# Altium schematic sheet Sensor_Filters.SchDoc
size B; SheetNumber: 12; SheetTotal: 12
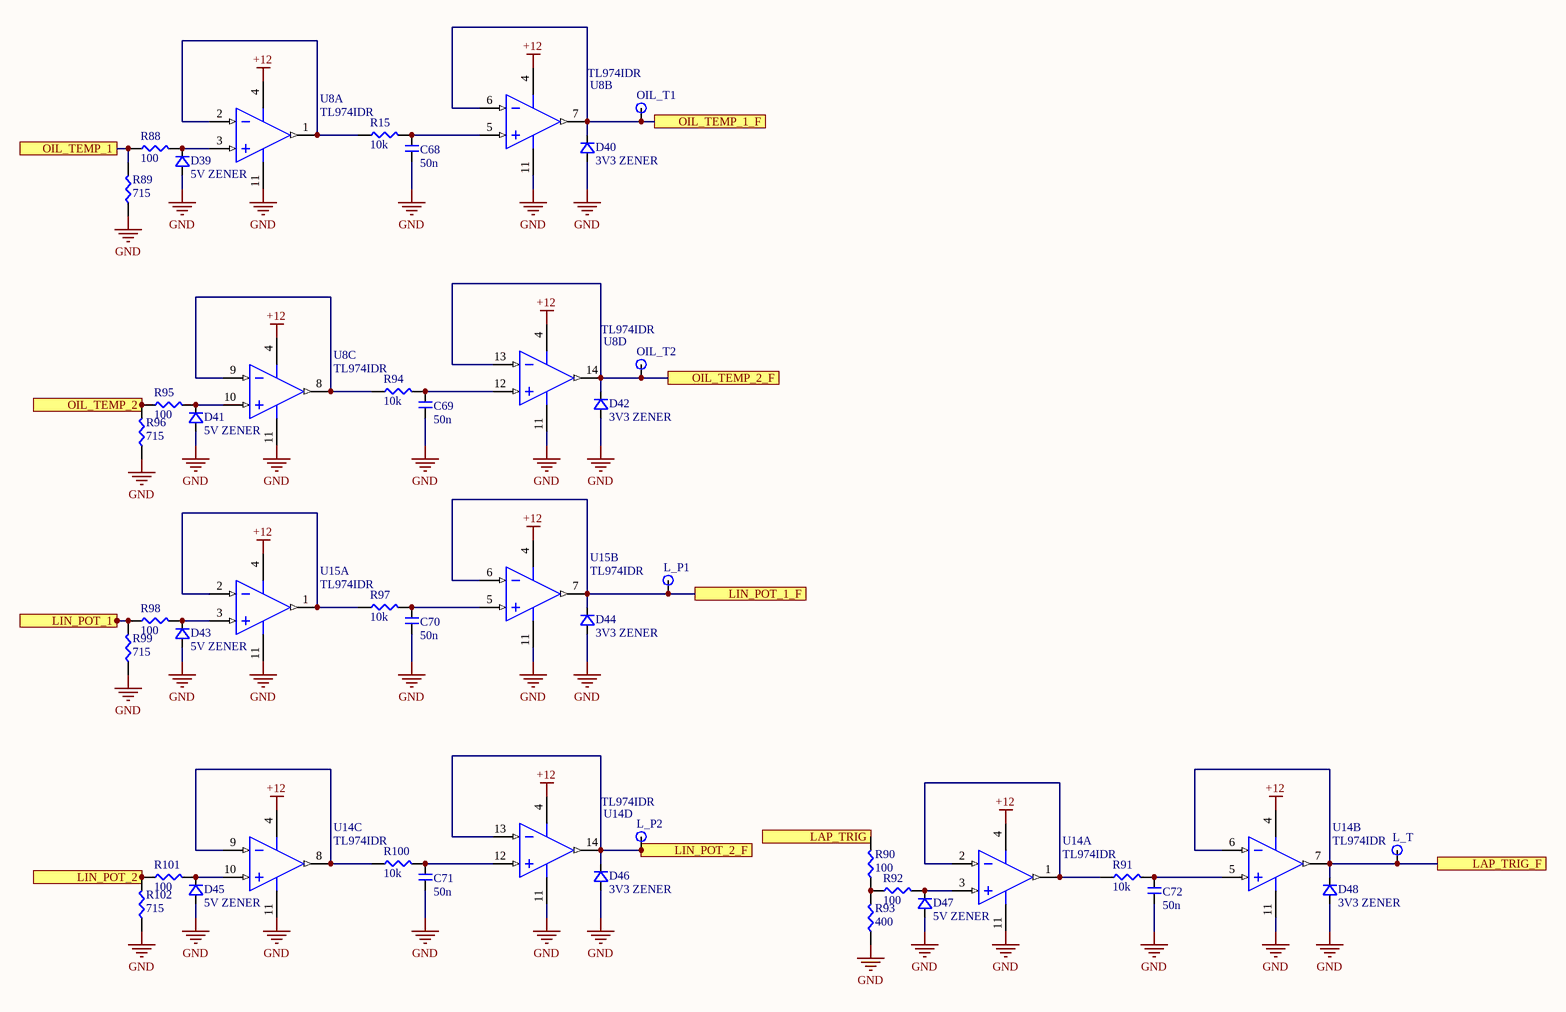
[diagram p0: Sensor_Filters.SchDoc]

## Parts
C68  50n  [CAP-0603]
C69  50n  [CAP-0603]
C70  50n  [CAP-0603]
C71  50n  [CAP-0603]
C72  50n  [CAP-0603]
D39  5V ZENER  [SOD123]
D40  3V3 ZENER  [SOD123]
D41  5V ZENER  [SOD123]
D42  3V3 ZENER  [SOD123]
D43  5V ZENER  [SOD123]
D44  3V3 ZENER  [SOD123]
D45  5V ZENER  [SOD123]
D46  3V3 ZENER  [SOD123]
D47  5V ZENER  [SOD123]
D48  3V3 ZENER  [SOD123]
L_P1  (no value)  [Testpoint]
L_P2  (no value)  [Testpoint]
L_T  (no value)  [Testpoint]
OIL_T1  (no value)  [Testpoint]
OIL_T2  (no value)  [Testpoint]
R15  10k  [RES-0603]
R88  100  [RES-0603]
R89  715  [RES-0603]
R90  100  [RES-0603]
R91  10k  [RES-0603]
R92  100  [RES-0603]
R93  400  [RES-0603]
R94  10k  [RES-0603]
R95  100  [RES-0603]
R96  715  [RES-0603]
R97  10k  [RES-0603]
R98  100  [RES-0603]
R99  715  [RES-0603]
R100  10k  [RES-0603]
R101  100  [RES-0603]
R102  715  [RES-0603]
U8  TL974IDR  [D0014A_M]  (parts A,B,C,D of 4)
U14  TL974IDR  [D0014A_M]  (parts A,B,C,D of 4)
U15  TL974IDR  [D0014A_M]  (parts A,B of 4)

## Ports
LAP_TRIG, LAP_TRIG_F, LIN_POT_1, LIN_POT_1_F, LIN_POT_2, LIN_POT_2_F, OIL_TEMP_1, OIL_TEMP_1_F, OIL_TEMP_2, OIL_TEMP_2_F

## Nets
+12: U8.4(VCC+) U14.4(VCC+) U15.4(VCC+)
GND: C68.1 C69.1 C70.1 C71.1 C72.1 D39.A D40.A D41.A D42.A D43.A D44.A D45.A D46.A D47.A D48.A R89.1 R93.1 R96.1 R99.1 R102.1 U8.11(VCC-) U14.11(VCC-) U15.11(VCC-)
LAP_TRIG: R90.2 ; port LAP_TRIG
LAP_TRIG_F: D48.K L_T.1 U14.6(IN2-) U14.7(OUT2) ; port LAP_TRIG_F
LIN_POT_1: R98.1 R99.2 ; port LIN_POT_1
LIN_POT_1_F: D44.K L_P1.1 U15.6(IN2-) U15.7(OUT2) ; port LIN_POT_1_F
LIN_POT_2: R101.1 R102.2 ; port LIN_POT_2
LIN_POT_2_F: D46.K L_P2.1 U14.13(IN4-) U14.14(OUT4) ; port LIN_POT_2_F
OIL_TEMP_1: R88.1 R89.2 ; port OIL_TEMP_1
OIL_TEMP_1_F: D40.K OIL_T1.1 U8.6(IN2-) U8.7(OUT2) ; port OIL_TEMP_1_F
OIL_TEMP_2: R95.1 R96.2 ; port OIL_TEMP_2
OIL_TEMP_2_F: D42.K OIL_T2.1 U8.13(IN4-) U8.14(OUT4) ; port OIL_TEMP_2_F
NetC68_2: C68.2 R15.2 U8.5(IN2+)
NetC69_2: C69.2 R94.2 U8.12(IN4+)
NetC70_2: C70.2 R97.2 U15.5(IN2+)
NetC71_2: C71.2 R100.2 U14.12(IN4+)
NetC72_2: C72.2 R91.2 U14.5(IN2+)
NetD39_K: D39.K R88.2 U8.3(IN1+)
NetD41_K: D41.K R95.2 U8.10(IN3+)
NetD43_K: D43.K R98.2 U15.3(IN1+)
NetD45_K: D45.K R101.2 U14.10(IN3+)
NetD47_K: D47.K R92.2 U14.3(IN1+)
NetR15_1: R15.1 U8.1(OUT1) U8.2(IN1-)
NetR90_1: R90.1 R92.1 R93.2
NetR91_1: R91.1 U14.1(OUT1) U14.2(IN1-)
NetR94_1: R94.1 U8.8(OUT3) U8.9(IN3-)
NetR97_1: R97.1 U15.1(OUT1) U15.2(IN1-)
NetR100_1: R100.1 U14.8(OUT3) U14.9(IN3-)

## Library data of the parts
C68-C72 = CMP-009-000303-1: Source: ife19_Elec_Library.SchLib; Design Item ID: CAP-0603
D39-D48 = CMP-010-000008-1: Design Item ID: DIODE-SOD123; Source: ife19_Elec_Library.SchLib
L_P1 L_P2 L_T OIL_T1 OIL_T2 = CMP-009-000182-1: Design Item ID: Testpoint; Source: ife19_Elec_Library.SchLib
R15 R88-R102 = CMP-014-000032-1: Source: ife19_Elec_Library.SchLib; Design Item ID: RES-0603
U8 U14 U15 = CMP-0015-00021-2: Output Rail-To-Rail Very-Low-Noise Operational Amplifier, 2.7 to 12 V, -40 to 125 degC, 14-pin SOIC (D14), Green (RoHS & no Sb/Br); Manufacturer: Texas Instruments; GBW(Typ)(MHz): 12; Vio (25C)(Max)(mV): 4; Offset Drift(Typ)(uV/C): 5; IIB(Max)(pA): 750000; Sub Family: General Purpose Amplifier, Low Supply Voltage Amplifier (<=2.7V); Total Supply Voltage(Min)(+5V is 5, +/-5V is 10): 2.7; Iq per channel(Max)(mA): 2.8; Rating: Catalog; CMRR(Min)(dB): 60; PackageReference: D0014A; DatasheetVersion: SLOS467G; Code_JEDEC: MS-012; PartNumber: TL974IDR; ComponentLink3Description: Package Specification; Number of Channels: 4; Slew Rate(Typ)(V/us): 5; Mounting Technology: Surface Mount; ComponentLink2Description: Datasheet; Eco-Plan: Green (RoHS & no Sb/Br); ComponentLink1Description: Manufacturer URL; ComponentLink2URL: http://www.ti.com/lit/ds/symlink/tl974.pdf; ComponentLink1URL: http://www.ti.com/; Total Supply Voltage(Max)(+5V is 5, +/-5V is 10): 12; PackageDescription: 14-Pin Plastic Small Outline, Body 8.65 x 3.90 mm, Pitch 1.27 mm; PackageVersion: 4040047-5/M, 06/2011; ComponentLink3URL: http://www.ti.com/lit/ml/mpds177g/mpds177g.pdf